# Altium schematic sheet G431.SchDoc
size A4; Organization: Waterloop; Address1: 200 University Ave W; Address2: Engineering 5, 1104; Address3: Waterloo, ON; Address4: N2L 3G1; SheetNumber: 2; SheetTotal: 2
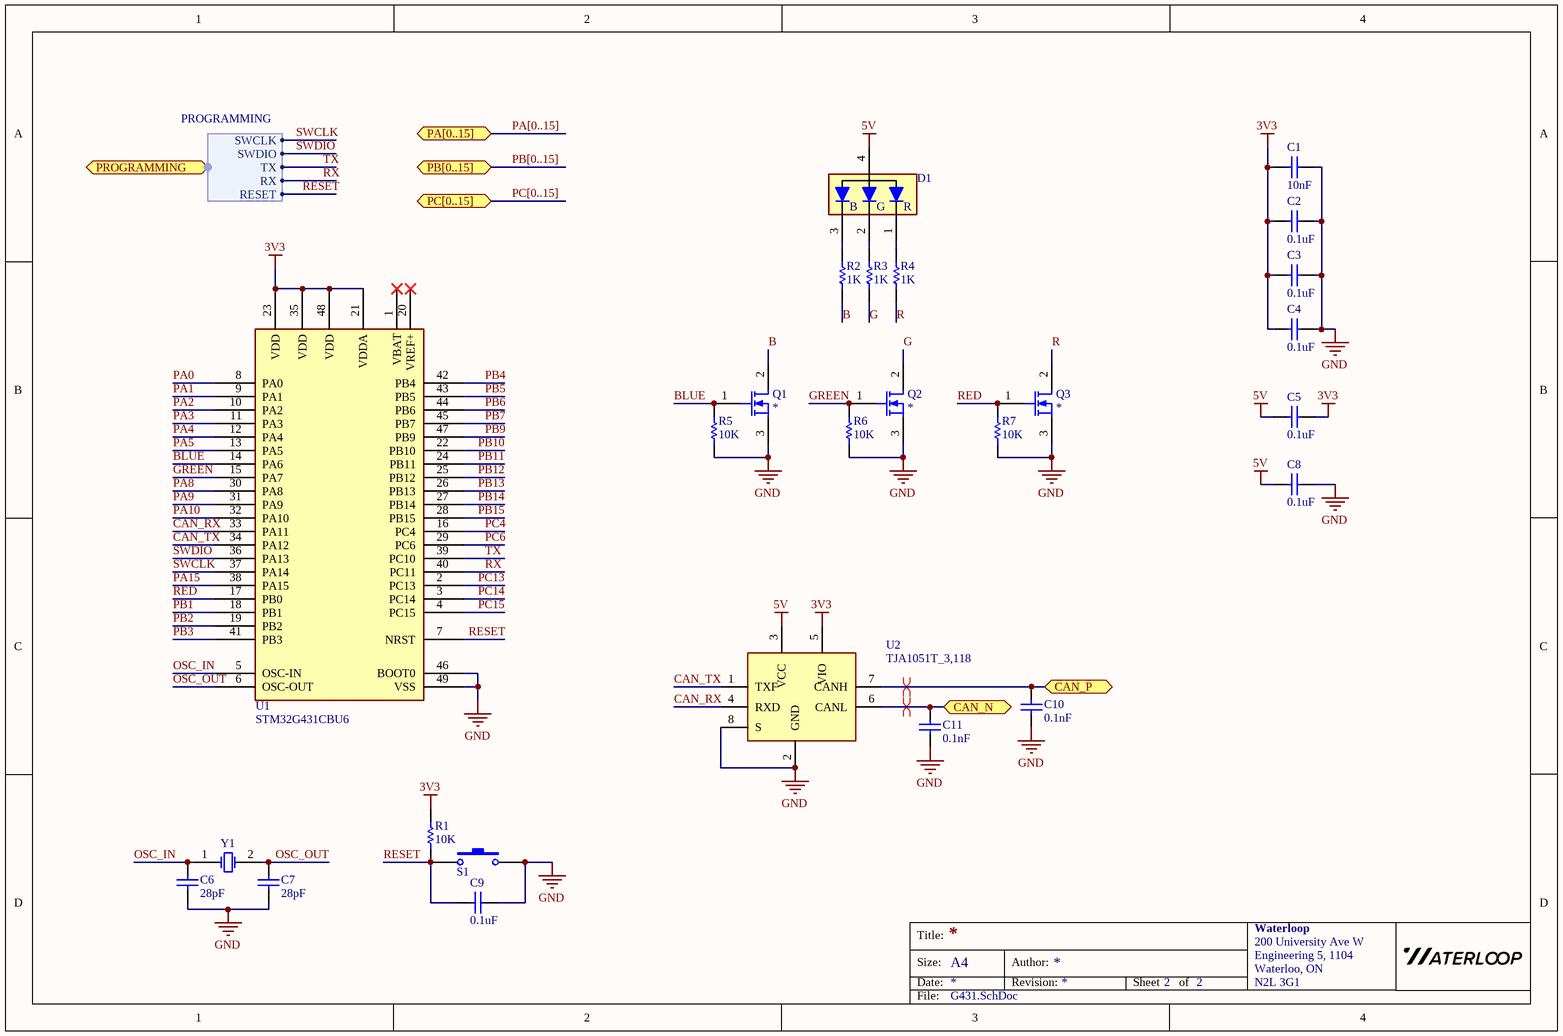
[diagram p0: G431.SchDoc]

## Parts
C1  value 10nF  [0805 - Capacitor]  (hidden comment: Capacitor - Nonpolarized)
C2  value 0.1uF  [0805 - Capacitor]  (hidden comment: Capacitor - Nonpolarized)
C3  value 0.1uF  [0805 - Capacitor]  (hidden comment: Capacitor - Nonpolarized)
C4  value 0.1uF  [0805 - Capacitor]  (hidden comment: Capacitor - Nonpolarized)
C5  value 0.1uF  [0805 - Capacitor]  (hidden comment: Capacitor - Nonpolarized)
C6  value 28pF  [0805 - Capacitor]  (hidden comment: Capacitor - Nonpolarized)
C7  value 28pF  [0805 - Capacitor]  (hidden comment: Capacitor - Nonpolarized)
C8  value 0.1uF  [0805 - Capacitor]  (hidden comment: Capacitor - Nonpolarized)
C9  value 0.1uF  [0805 - Capacitor]  (hidden comment: Capacitor - Nonpolarized)
C10  value 0.1nF  [0805 - Capacitor]  (hidden comment: Capacitor - Nonpolarized)
C11  value 0.1nF  [0805 - Capacitor]  (hidden comment: Capacitor - Nonpolarized)
D1  RGB LED- Common Anode  [4-PLCC RGB LED]  (value not drawn)
Q1  MOSFET-N  [SC70/SOT323]  (value not drawn)
Q2  MOSFET-N  [SC70/SOT323]  (value not drawn)
Q3  MOSFET-N  [SC70/SOT323]  (value not drawn)
R1  value 10K  [0603 - Resistor]  (hidden comment: Resistor)
R2  value 1K  [0603 - Resistor]  (hidden comment: Resistor)
R3  value 1K  [0603 - Resistor]  (hidden comment: Resistor)
R4  value 1K  [0603 - Resistor]  (hidden comment: Resistor)
R5  value 10K  [0603 - Resistor]  (hidden comment: Resistor)
R6  value 10K  [0603 - Resistor]  (hidden comment: Resistor)
R7  value 10K  [0603 - Resistor]  (hidden comment: Resistor)
S1  Switch - Push Button  [6x6mm Switch]  (value not drawn)
U1  STM32G431CBU6  [STM32G431CBU6]
U2  TJA1051T_3,118  [TJA1051T/3,118]
Y1  Oscillator  [2-SMD NO LEAD CRSYSTAL]  (value not drawn)

## Ports
CAN_N (bidir), CAN_P (bidir), PA[0..15] (bidir), PB[0..15] (bidir), PC[0..15] (bidir), PROGRAMMING (bidir, harness PROGRAMMING)

## Harnesses
PROGRAMMING: SWCLK, SWDIO, TX, RX, RESET

## Nets
3V3: C1.1 C2.1 C3.1 C4.1 C5.2 R1.2 U1.21(VDDA) U1.23(VDD) U1.35(VDD) U1.48(VDD) U2.5(VIO)
5V: C5.1 C8.1 D1.4 U2.3(VCC)
GND: C1.2 C2.2 C3.2 C4.2 C6.1 C7.1 C8.2 C9.2 C10.1 C11.1 Q1.3(S) Q2.3(S) Q3.3(S) R5.1 R6.1 R7.1 S1.2 U1.46(BOOT0) U1.49(VSS) U2.2(GND) U2.8(S)
B: Q1.2(D) R2.1
BLUE: Q1.1(G) R5.2 U1.14(PA6)
CAN_N: C11.2 U2.6(CANL) ; port CAN_N
CAN_P: C10.2 U2.7(CANH) ; port CAN_P
CAN_RX: U1.33(PA11) U2.4(RXD)
CAN_TX: U1.34(PA12) U2.1(TXF)
G: Q2.2(D) R3.1
GREEN: Q2.1(G) R6.2 U1.15(PA7)
OSC_IN: C6.2 U1.5(OSC-IN) Y1.1(OSC1)
OSC_OUT: C7.2 U1.6(OSC-OUT) Y1.2(OSC2)
PA0: U1.8(PA0)
PA1: U1.9(PA1)
PA2: U1.10(PA2)
PA3: U1.11(PA3)
PA4: U1.12(PA4)
PA5: U1.13(PA5)
PA8: U1.30(PA8)
PA9: U1.31(PA9)
PA10: U1.32(PA10)
PA15: U1.38(PA15)
PB1: U1.18(PB1)
PB2: U1.19(PB2)
PB3: U1.41(PB3)
PB4: U1.42(PB4)
PB5: U1.43(PB5)
PB6: U1.44(PB6)
PB7: U1.45(PB7)
PB9: U1.47(PB9)
PB10: U1.22(PB10)
PB11: U1.24(PB11)
PB12: U1.25(PB12)
PB13: U1.26(PB13)
PB14: U1.27(PB14)
PB15: U1.28(PB15)
PC4: U1.16(PC4)
PC6: U1.29(PC6)
PC13: U1.2(PC13)
PC14: U1.3(PC14)
PC15: U1.4(PC15)
R: Q3.2(D) R4.1
RED: Q3.1(G) R7.2 U1.17(PB0)
RESET: C9.1 R1.1 S1.1 U1.7(NRST) ; port PROGRAMMING.RESET
RX: U1.40(PC11) ; port PROGRAMMING.RX
SWCLK: U1.37(PA14) ; port PROGRAMMING.SWCLK
SWDIO: U1.36(PA13) ; port PROGRAMMING.SWDIO
TX: U1.39(PC10) ; port PROGRAMMING.TX
NetD1_1: D1.1 R4.2
NetD1_2: D1.2 R3.2
NetD1_3: D1.3 R2.2

Not connected (* = marked no-connect by the designer): U1 1(VBAT)* 20(VREF+)*

## Buses and harness runs
bus PA[0..15] = port PA[0..15]
bus PB[0..15] = port PB[0..15]
bus PC[0..15] = port PC[0..15]

## Layout directives
differential pair: CAN_N, CAN_P

## Notes on the sheet
- Title:
- Size:
- Date:
- A4
- Author:
- Revision:
- Sheet
- of
- File:
- (in symbol RGB LED- Common Anode) B; G; R

## Library data of the parts
C1-C11 = Capacitor - Nonpolarized: Nonpolarized Capacitor; Supplier Part Number: *; Supplier: *; Manufacturer: *; Rating: *; Manufacturer Part Number: *
Q1-Q3 = MOSFET-N: N-Channel MOSFET; Supplier: *; Manufacturer Part Number: *; Supplier Part Number: *; Rating: *; Manufacturer: *; Value: *
S1 = Switch - Push Button: Push Button Switch; Supplier: *; Manufacturer Part Number: *; Manufacturer: *; Supplier Part Number: *; Rating: *; Value: *
U1 = STM32G431CBU6: 128K FLASH + 32K RAM MICRO; Manufacturer: ST; Manufacturer Part Number: STM32G431CBU6; Supplier Part Number: C529356; Supplier: JLCPCB; ComponentLink1Description: Datasheet; ComponentLink1URL: https://www.st.com/resource/en/datasheet/stm32g431cb.pdf
U2 = TJA1051T_3,118: CAN Transceiver IC 4.5V-5.5V 250ns; Manufacturer: NXP; Manufacturer Part Number: TJA1051T/3,118; Supplier Part Number: 568-8684-1-ND; Supplier: Digikey; ComponentLink1Description: Datasheet; ComponentLink1URL: http://www.nxp.com/docs/en/data-sheet/TJA1051.pdf
Y1 = Oscillator: Crystal Oscillator; Value: 24 MHz; Manufacturer Part Number: *; Manufacturer: *; Supplier Part Number: *; Supplier: *; Rating: *
D1 = RGB LED- Common Anode: Manufacturer Part Number: *; Manufacturer: *; Supplier Part Number: *; Supplier: *
R1-R7 = Resistor: Rating: *; Manufacturer Part Number: *; Manufacturer: *; Supplier Part Number: *; Supplier: *